# EAGLE design bc-module-epaper (EAGLE 9.6.0)

## Sheet 1 of 2
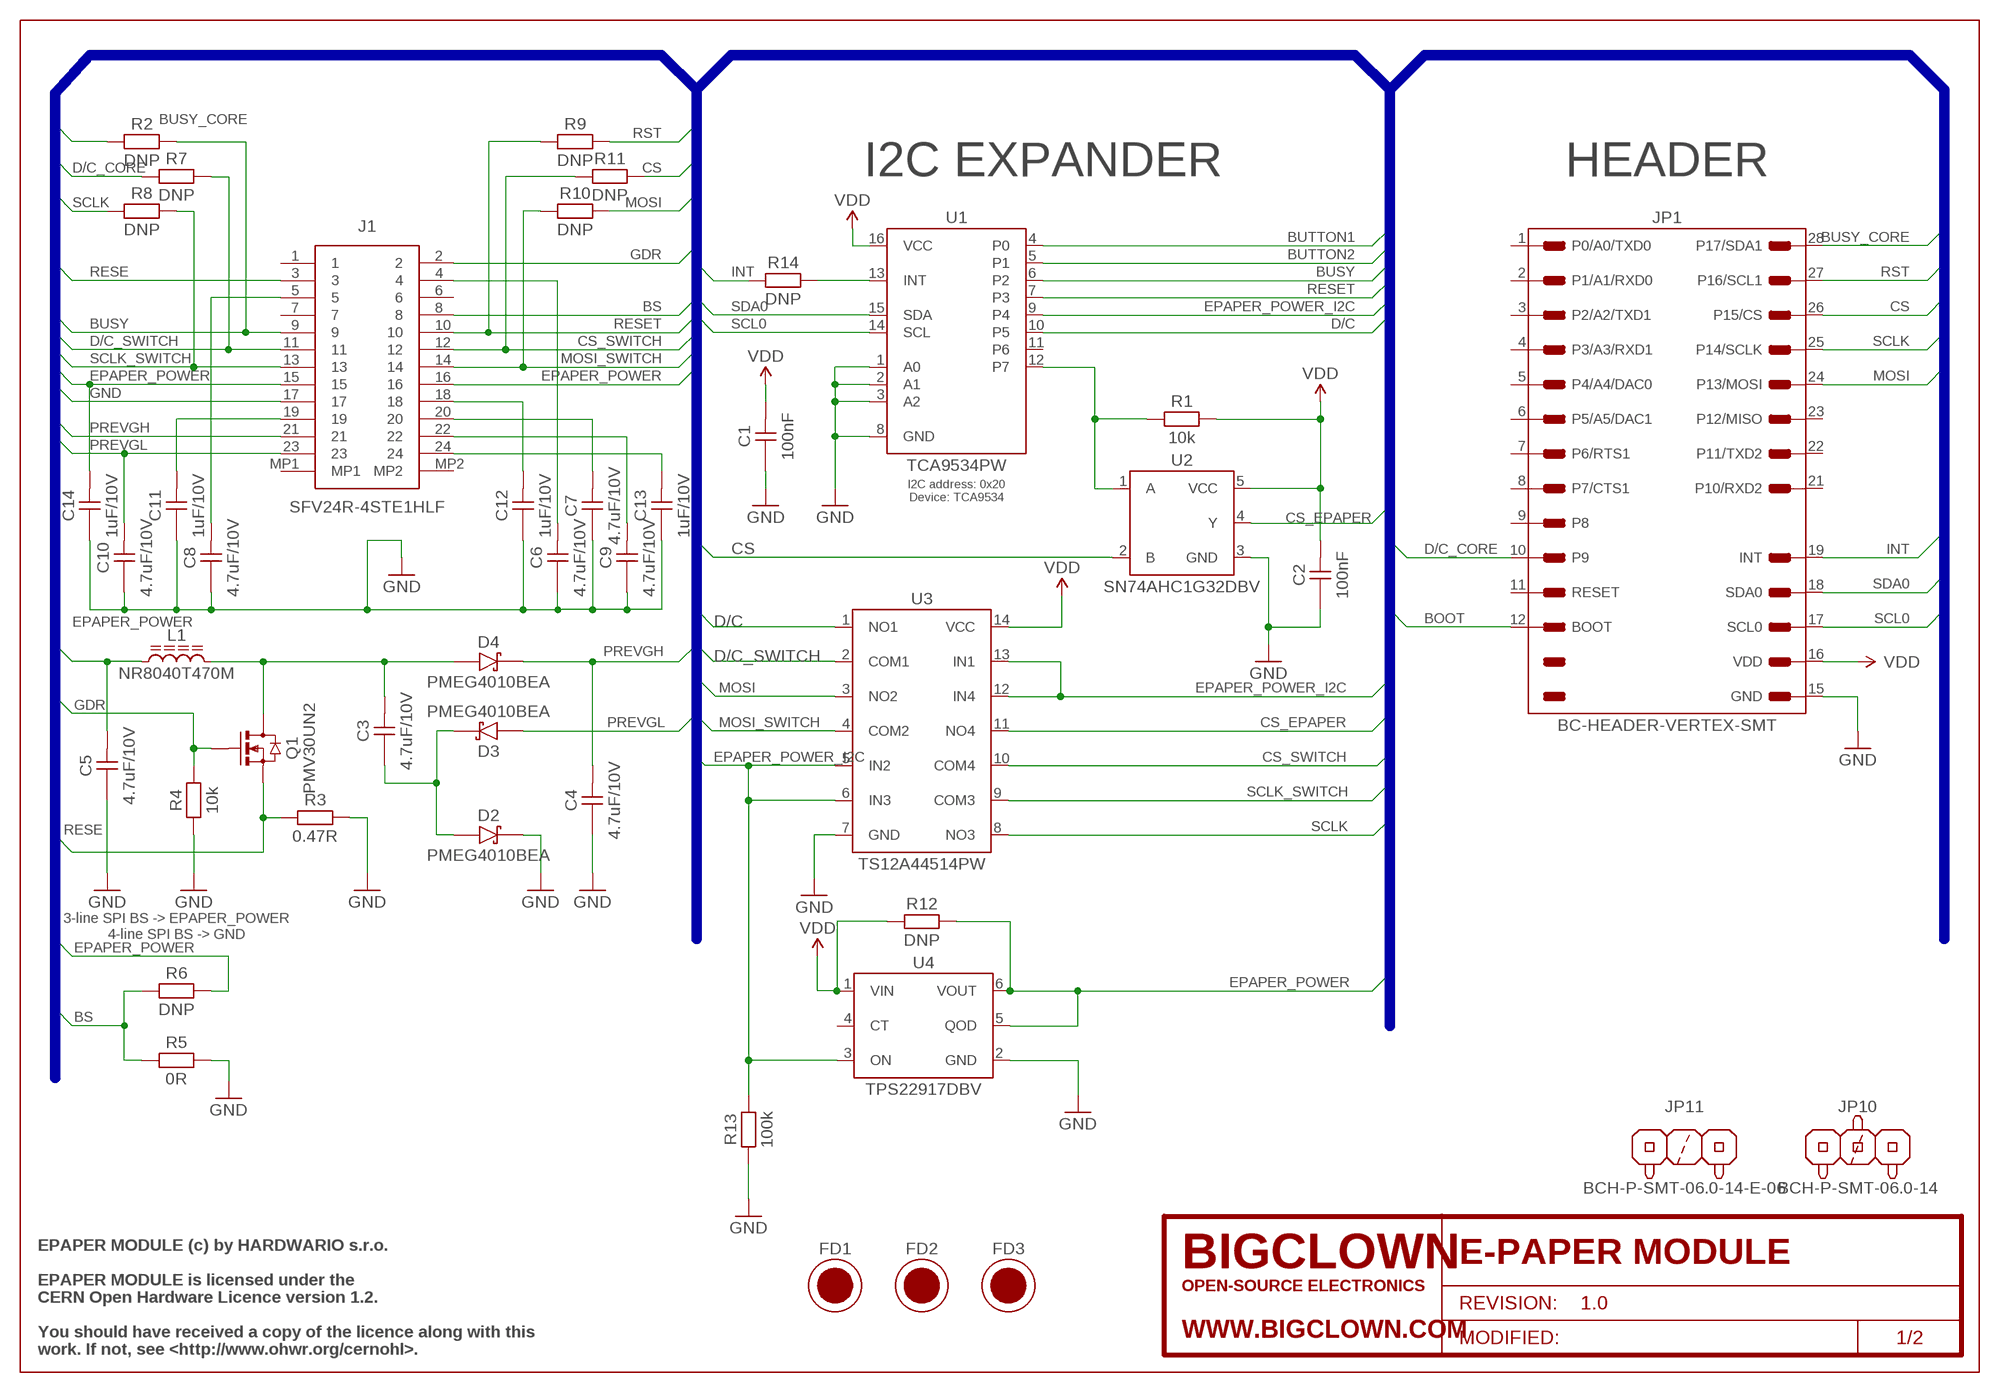
[diagram p0: schematic, sheet 1]

### Parts
C1  100nF  C-0402-100NF  [CAPACITOR-0402_R]
C2  100nF  C-0402-100NF  [CAPACITOR-0402_R]
C3  4.7uF/10V  C-0402-4.7UF-10V  [CAPACITOR-0402_R]
C4  4.7uF/10V  C-0402-4.7UF-10V  [CAPACITOR-0402_R]
C5  4.7uF/10V  C-0402-4.7UF-10V  [CAPACITOR-0402_R]
C6  4.7uF/10V  C-0402-4.7UF-10V  [CAPACITOR-0402_R]
C7  4.7uF/10V  C-0402-4.7UF-10V  [CAPACITOR-0402_R]
C8  4.7uF/10V  C-0402-4.7UF-10V  [CAPACITOR-0402_R]
C9  4.7uF/10V  C-0402-4.7UF-10V  [CAPACITOR-0402_R]
C10  4.7uF/10V  C-0402-4.7UF-10V  [CAPACITOR-0402_R]
C11  1uF/10V  C-0402-1UF-10V  [CAPACITOR-0402_R]
C12  1uF/10V  C-0402-1UF-10V  [CAPACITOR-0402_R]
C13  1uF/10V  C-0402-1UF-10V  [CAPACITOR-0402_R]
C14  1uF/10V  C-0402-1UF-10V  [CAPACITOR-0402_R]
D2  PMEG4010BEA  D-PMEG4010BEA  [SOD-323_R]
D3  PMEG4010BEA  D-PMEG4010BEA  [SOD-323_R]
D4  PMEG4010BEA  D-PMEG4010BEA  [SOD-323_R]
FD1  FIDUCIAL  [FIDUCIAL-1MM]
FD2  FIDUCIAL  [FIDUCIAL-1MM]
FD3  FIDUCIAL  [FIDUCIAL-1MM]
FRAME1  FRAME-SCH/A4L-BRD/A4L  [FRAME-A4L]
J1  SFV24R-4STE1HLF  [SFV24R4STE1HLF]
JP1  BC-HEADER-VERTEX-SMT  BC-HEADER-MODULE-VERTEX-SMT  [BC-HEADER-MODULE-VERTEX-SMT]
JP10  BCH-P-SMT-06.0-14  JP-BCH-P-SMT-06.0-14  [BCH-P-SMT-14]
JP11  BCH-P-SMT-06.0-14-E-06  JP-BCH-P-SMT-06.0-14-E-06  [BCH-P-SMT-14-E-06]
L1  NR8040T470M  L-NR8040T470M  [NR8040T470M_R]
Q1  PMV30UN2  Q-PMV30UN2  [SOT-23_R]
R1  10k  R-0402-10K  [RESISTOR-0402_R]
R2  DNP  R-0402-DNP  [RESISTOR-0402_R]
R3  0.47R  R-0402  [RESISTOR-0402_R]
R4  10k  R-0402-10K  [RESISTOR-0402_R]
R5  0R  R-0402-0R  [RESISTOR-0402_R]
R6  DNP  R-0402-DNP  [RESISTOR-0402_R]
R7  DNP  R-0402-DNP  [RESISTOR-0402_R]
R8  DNP  R-0402-DNP  [RESISTOR-0402_R]
R9  DNP  R-0402-DNP  [RESISTOR-0402_R]
R10  DNP  R-0402-DNP  [RESISTOR-0402_R]
R11  DNP  R-0402-DNP  [RESISTOR-0402_R]
R12  DNP  R-0402-DNP  [RESISTOR-0402_R]
R13  100k  R-0402-100K  [RESISTOR-0402_R]
R14  DNP  R-0402-DNP  [RESISTOR-0402_R]
U1  TCA9534PW  U-TCA9534PW  [TCA9534APW_R]
U2  SN74AHC1G32DBV  U-SN74AHC1G32DBV  [SN74AHC1G32DBV_R]
U3  TS12A44514PW  U-TS12A44514PWR  [TS12A44514PWR_R]
U4  TPS22917DBV  U-TPS22917DBV  [TPS22917DBV_R]

### Nets
BOOT: JP1.12(BOOT)
BS: J1.8 R5.1 R6.1
BUSY: J1.9 R2.2 U1.6(P2)
BUSY_CORE: JP1.28(P17/SDA1) R2.1
BUTTON1: U1.4(P0)
BUTTON2: U1.5(P1)
CS: JP1.26(P15/CS) R11.2 U2.2(B)
CS_EPAPER: U2.4(Y) U3.11(NO4)
CS_SWITCH: J1.12 R11.1 U3.10(COM4)
D/C: U1.10(P5) U3.1(NO1)
D/C_CORE: JP1.10(P9) R7.1
D/C_SWITCH: J1.11 R7.2 U3.2(COM1)
EPAPER_POWER: C5.1 C14.1 J1.15 J1.16 L1.1 R6.2 R12.2 U4.5(QOD) U4.6(VOUT)
EPAPER_POWER_I2C: R13.2 U1.9(P4) U3.5(IN2) U3.6(IN3) U3.12(IN4) U3.13(IN1) U4.3(ON)
GDR: J1.2 Q1.1(G) R4.2
GND: C1.2 C2.2 C4.2 C5.2 C6.2 C7.2 C8.2 C9.2 C10.2 C11.2 C12.2 C13.2 C14.2 D2.1(C) J1.17 JP1.15(GND) R3.2 R4.1 R5.2 R13.1 U1.1(A0) U1.2(A1) U1.3(A2) U1.8(GND) U2.3(GND) U3.7(GND) U4.2(GND)
INT: JP1.19(INT) R14.1
MOSI: JP1.24(P13/MOSI) R10.2 U3.3(NO2)
MOSI_SWITCH: J1.14 R10.1 U3.4(COM2)
N$1: C3.1 D4.2(A) L1.2 Q1.3(D)
N$2: C11.1 J1.19
N$3: C8.1 J1.5
N$4: C3.2 D2.2(A) D3.1(C)
N$5: C6.1 J1.4
N$6: C7.1 J1.20
N$7: C12.1 J1.18
N$8: R14.2 U1.13(INT)
OR_A: R1.2 U1.12(P7) U2.1(A)
PREVGH: C4.1 D4.1(C) J1.21
PREVGL: C10.1 D3.2(A) J1.23
RESE: J1.3 Q1.2(S) R3.1
RESET: J1.10 R9.1 U1.7(P3)
RST: JP1.27(P16/SCL1) R9.2
SCL0: JP1.17(SCL0) U1.14(SCL)
SCLK: JP1.25(P14/SCLK) R8.1 U3.8(NO3)
SCLK_SWITCH: J1.13 R8.2 U3.9(COM3)
SDA0: JP1.18(SDA0) U1.15(SDA)
VCOM: C13.1 J1.24
VDD: C1.1 C2.1 JP1.16(VDD) R1.1 R12.1 U1.16(VCC) U2.5(VCC) U3.14(VCC) U4.1(VIN)
VSL: C9.1 J1.22
Unconnected: J1.1 J1.6 J1.7 J1.MP1 J1.MP2 JP1.1(P0/A0/TXD0) JP1.2(P1/A1/RXD0) JP1.3(P2/A2/TXD1) JP1.4(P3/A3/RXD1) JP1.5(P4/A4/DAC0) JP1.6(P5/A5/DAC1) JP1.7(P6/RTS1) JP1.8(P7/CTS1) JP1.9(P8) JP1.11(RESET) JP1.21(P10/RXD2) JP1.22(P11/TXD2) JP1.23(P12/MISO) U1.11(P6) U4.4(CT)

### Buses
BOOT,BS,BUSY,BUSY_CORE,BUTTON1,BUTTON2,BUTTON3,BUTTON4,CS,CS_EPAPER,CS_SWITCH,D/C,D/C_CORE,D/C_SWITCH,EPAPER_POWER,EPAPER_POWER_I2C,GDR,GND,INT,MOSI,MOSI_SWITCH,OR_A,PREVGH,PREVGL,RESE,RESET,RST,SCL0,SCLK,SCLK_SWITCH,SDA0,VCOM,VDD,VDDD,VGH,VGL,VPP,VSH,VSL

### Notes on the sheet
- I2C EXPANDER | HEADER
- I2C address: 0x20
  Device: TCA9534
- 3-line SPI BS -> EPAPER_POWER
  4-line SPI BS -> GND
- EPAPER MODULE (c) by HARDWARIO s.r.o.
- EPAPER MODULE is licensed under the
- CERN Open Hardware Licence version 1.2.
- You should have received a copy of the licence along with this
- work. If not, see <http://www.ohwr.org/cernohl>.

## Sheet 2 of 2
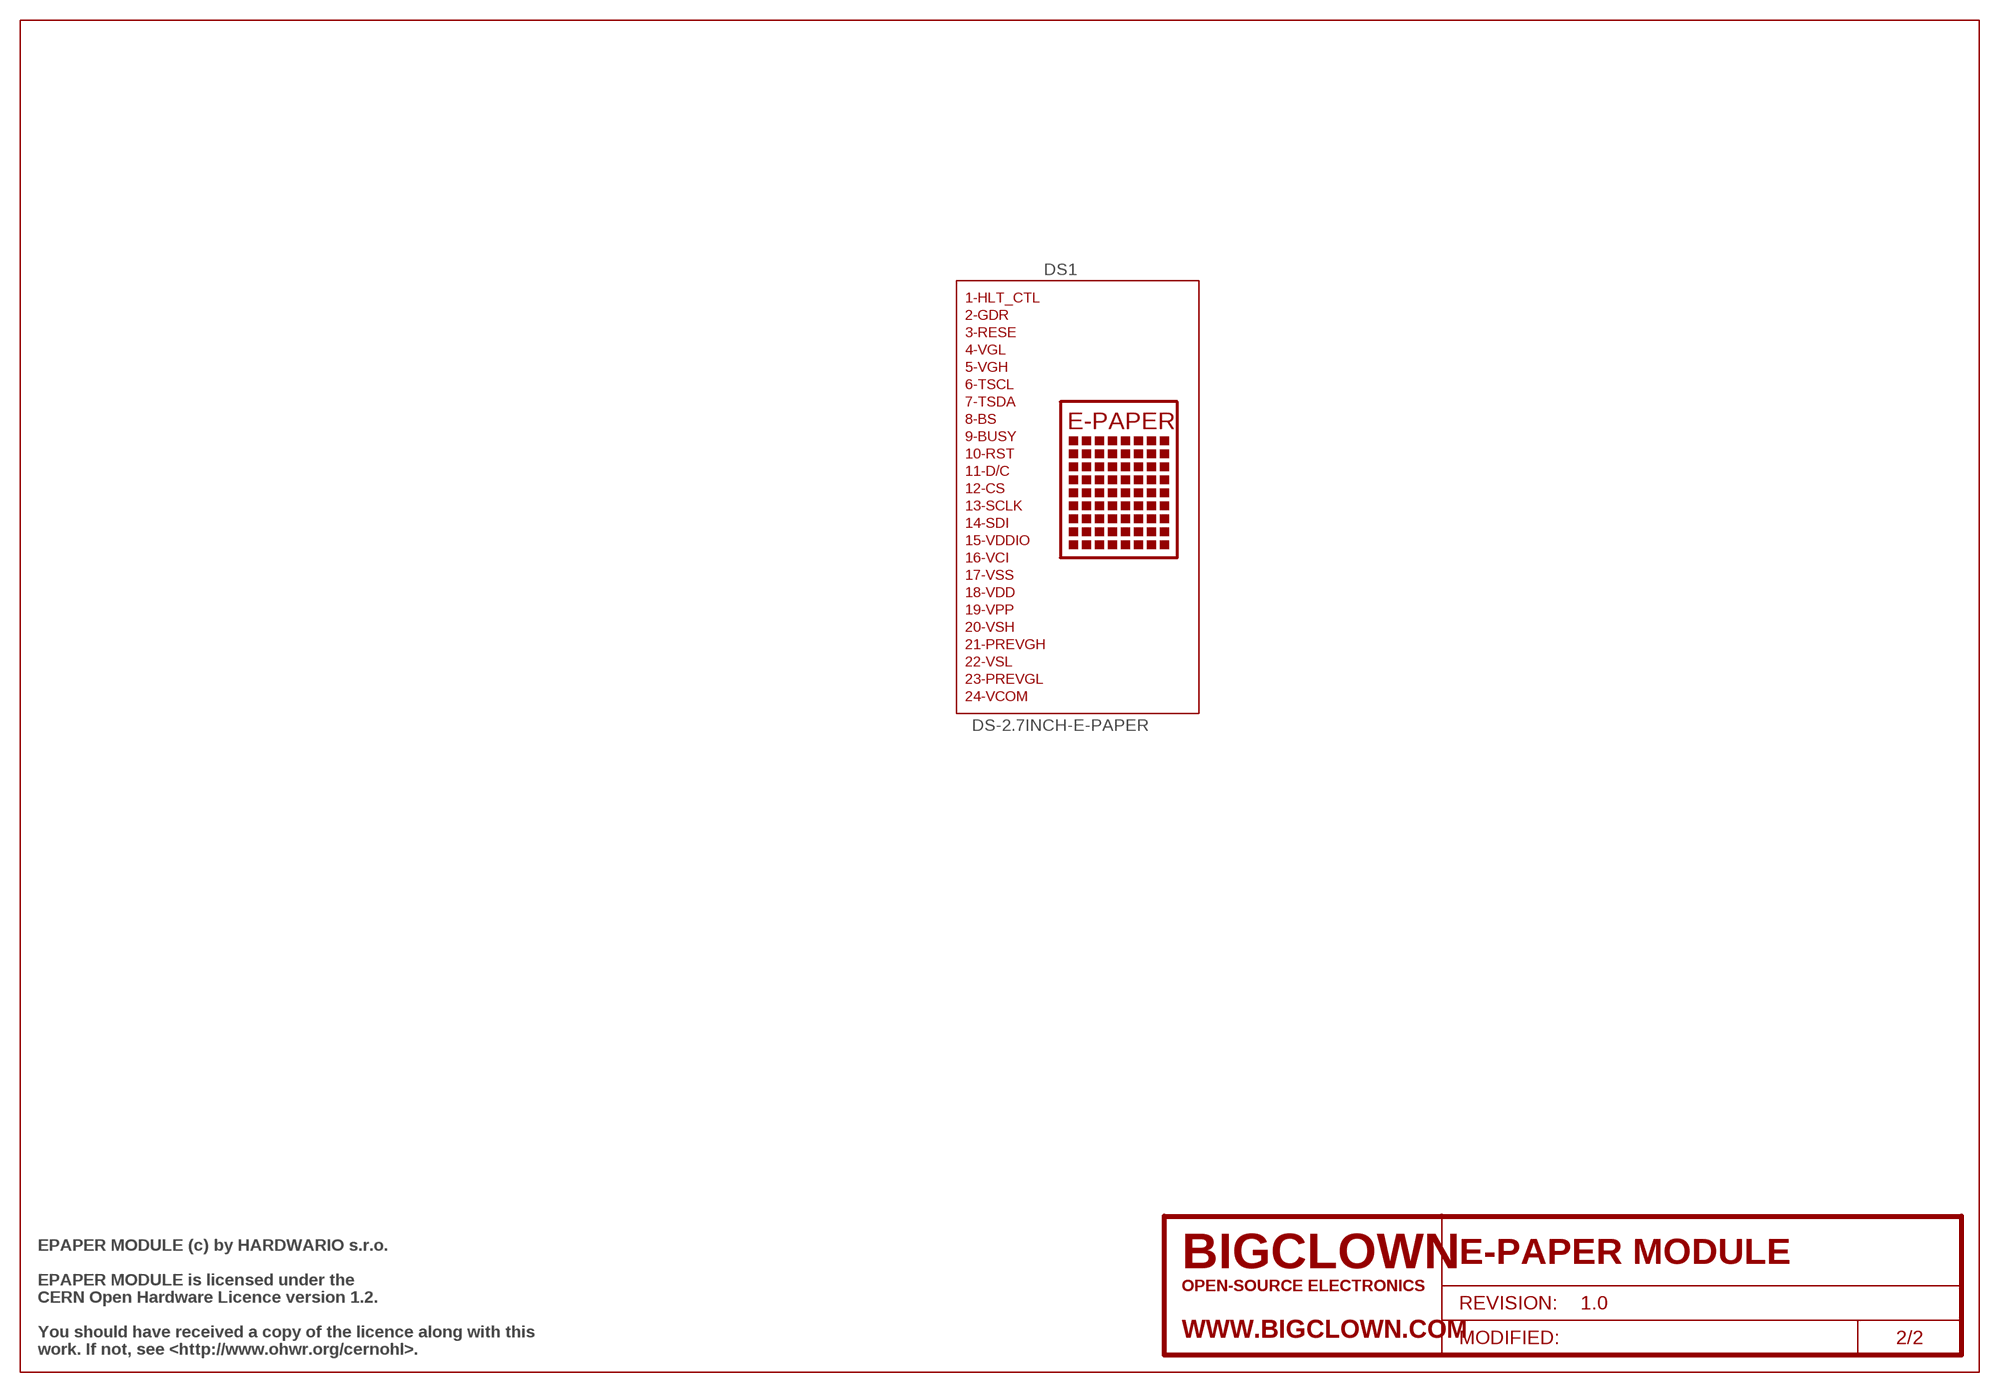
[diagram p1: schematic, sheet 2]

### Parts
DS1  DS-2.7INCH-E-PAPER  [2.7INCH-E-PAPER]
FRAME3  FRAME-SCH/A4L-BRD/A4L  [FRAME-A4L]

### Notes on the sheet
- EPAPER MODULE (c) by HARDWARIO s.r.o.
- EPAPER MODULE is licensed under the
- CERN Open Hardware Licence version 1.2.
- You should have received a copy of the licence along with this
- work. If not, see <http://www.ohwr.org/cernohl>.

## Library data of the parts
C1 C2 = bc-capacitor:C-0402-100NF: Capacitor 100nF 10% ≥10V X7R Package Description: 0402 Mounting Technology: SMT Supplier Name: JabloPCB Supplier Part Number: P+CSM-019.02 Unit Price CZK: 0.2180; BCPN: BC-C-0402-100NF
C3-C10 = bc-capacitor:C-0402-4.7UF-10V: Capacitor 4.7uF 10% 10V X5R Package Description: 0402 Mounting Technology: SMT Supplier Name: JabloPCB Supplier Part Number: P+CSM-035.51 Unit Price CZK: 1.1190; BCPN: BC-C-0402-4.7UF-10V
C11-C14 = bc-capacitor:C-0402-1UF-10V: Capacitor 1uF 10% 10V X5R Part Status: Core Package Description: 0402 Mounting Technology: SMT Supplier Name: JabloPCB Supplier Part Number: P+CSM-034.00 Unit Price CZK: 0.1480; BCPN: BC-C-0402-1UF-10V
D2-D4 = bc-discrete:D-PMEG4010BEA: Shottky Diode 1A 40V 0,64V Ir 20 uA Part Status: Power Package Description: SOD-323 Mounting Technology: SMT; BCPN: BC-D-PMEG4010BEA
DS1 = bc-display:DS-2.7INCH-E-PAPER: E-PAPER 2.7" 264x176 Package Description: 70.42x45.8mm Manufacturer Name: WAVESHARE Manufacturer Part Number: 2.7inch e-Paper Supplier Name: WAVESHARE Unit Price USD: 9.99; BCPN: BC-DS-2.7INCH-E-PAPER
FD1-FD3 = bc-fiducial:FIDUCIAL; BCPN: -
FRAME1 FRAME3 = bc-frame:FRAME-SCH/A4L-BRD/A4L; BCPN: -; PROJECT_NAME: E-PAPER MODULE; PROJECT_REVISION: 1.0
J1 = SFV24R-4STE1HLF:SFV24R-4STE1HLF: FFC & FPC Connectors 24P R/A SMT FFC/FPC 0.5mm CONT SPACING Source: Datasheet <https://componentsearchengine.com/Datasheets/1/SFV24R-4STE1HLF.pdf>; DESCRIPTION: FFC & FPC Connectors 24P R/A SMT FFC/FPC 0.5mm CONT SPACING; HEIGHT: 2mm; MANUFACTURER_NAME: FCI; MANUFACTURER_PART_NUMBER: SFV24R-4STE1HLF; MOUSER_PART_NUMBER: 649-SFV24R-4STE1HLF; MOUSER_PRICE-STOCK: https://www.mouser.com/Search/Refine.aspx?Keyword=649-SFV24R-4STE1HLF
JP1 = bc-header:BC-HEADER-MODULE-VERTEX-SMT: 14pin SMT pin header +14pin SMT pin header empty pin 6 with no socket position from top side of PCB Use this pattern for a top floor Module of BigClown stackup without top connector for next module and without additional power supply (e. g. LCD Module, Climate Module, PIR Module). Mounting Technology: SMT; BCPN: -
JP10 = bc-header:JP-BCH-P-SMT-06.0-14: SMT Pin 6.0mm 14-pin type 1 Part Status: A Package Description: pitch 2.54mm Mounting Technology: SMT Manufacturer Name: Amtek Manufacturer Part Number: 5PH1MSB25-114S0NBCU-060050033-0 Supplier Name: Amtek Unit Price CZK: 2.5520 Unit Price USD: 0.1160 MPU (pcs): 15; BCPN: BC-JP-BCH-P-SMT-06.0-14
JP11 = bc-header:JP-BCH-P-SMT-06.0-14-E-06: SMT Pin 6.0mm 14-pin type 1 empty pin 6 Part Status: A Package Description: pitch 2.54mm Mounting Technology: SMT Manufacturer Name: Amtek Manufacturer Part Number: 5PH1MSB25-114S0NBCU-060050M01-01 Supplier Name: Amtek Unit Price CZK: 2.7214 Unit Price USD: 0.1237 MPU (pcs): 15; BCPN: BC-JP-BCH-P-SMT-06.0-14-E-06
L1 = bc-inductor:L-NR8040T470M: Inductor 47uH 20% 1.4A 0.15Ohm Part Status: Power Package Description: 8.0x8.0mm Mounting Technology: SMT Manufacturer Name: Taiyo Yuden Manufacturer Part Number: NR8040T470M Supplier Name: Mouser, Avnet, DK Unit Price CZK: 0.0000; BCPN: BC-L-NR8040T470M
Q1 = bc-discrete:Q-PMV30UN2: N-MOS 20V 5.4A 24mOhm Package Description: SOT-23 Mounting Technology: SMT Manufacturer Name: Nexperia Manufacturer Part Number: PMV30UN2 Supplier Name: Avnet Silica Unit Price CZK: 0.9620 Unit Price EUR: 0.037 MOQ (pcs): 12000 MPU (pcs): 3000 L/T (weeks): 2; BCPN: BC-Q-PMV30UN2
R1 R4 = bc-resistor:R-0402-10K: Resistor 10k 1% 100ppm 63mW Package Description: 0402 Mounting Technology: SMT Supplier Name: JabloPCB Supplier Part Number: RSM-248.00 Unit Price CZK: 0.0180; BCPN: BC-R-0402-10K
R2 R6-R12 R14 = bc-resistor:R-0402-DNP; BCPN: -
R3 = bc-resistor:R-0402
R5 = bc-resistor:R-0402-0R: Resistor 0R 63mW Package Description: 0402 Mounting Technology: SMT Supplier Name: JabloPCB Unit Price CZK: 0.0500; BCPN: BC-R-0402-0R
R13 = bc-resistor:R-0402-100K: Resistor 100k 1% 100ppm 63mW Part Status: Core Package Description: 0402 Mounting Technology: SMT Supplier Name: JabloPCB Supplier Part Number: RSM-260.00 Unit Price CZK: 0.0180; BCPN: BC-R-0402-100K
U1 = bc-interface:U-TCA9534PW: I2C Expander 1.65-5.5V, alternate address to TCA9534A Package Description: TSSOP-16 Mounting Technology: SMT Manufacturer Name: Texas Instruments Manufacturer Part Number: TCA9534APWR Supplier Name: EBV Unit Price CZK: 6.6000 Unit Price USD: 0.3000 MOQ (pcs): 2000; BCPN: BC-U-TCA9534PW
U2 = bc-logic:U-SN74AHC1G32DBV: OR Gate 2.0-5.5V 10µA Package Description: SOT-23 Mounting Technology: SMT Manufacturer Name: Texas Instruments Manufacturer Part Number: SN74AHC1G32DBV Supplier Name: EBV Unit Price CZK: 0.6600 Unit Price USD: 0.0300 MOQ (pcs): 3000 L/T (weeks): 6; BCPN: BC-U-SN74AHC1G32DBV
U3 = bc-switch:U-TS12A44514PWR: Analog switch 4-Channel SPST 3.5 Ohm 2-12 V Package Description: TSSOP-14 Mounting Technology: SMT Manufacturer Name: Texas Instruments Manufacturer Part Number: TS12A44514PWR Supplier Name: Mouser; BCPN: BC-U-TS12A44514PW
U4 = bc-switch:U-TPS22917DBV: Load switch P-MOS 1-1.55V 2A 90mOhm @-3.6V Package Description: SOT-23-6 Mounting Technology: SMT Manufacturer Name: Texas Instruments Manufacturer Part Number: TPS22917DBV Supplier Name: EBV Unit Price CZK: 3.5200 Unit Price USD: 0.1600; BCPN: BC-U-TPS22917DBV

## Board
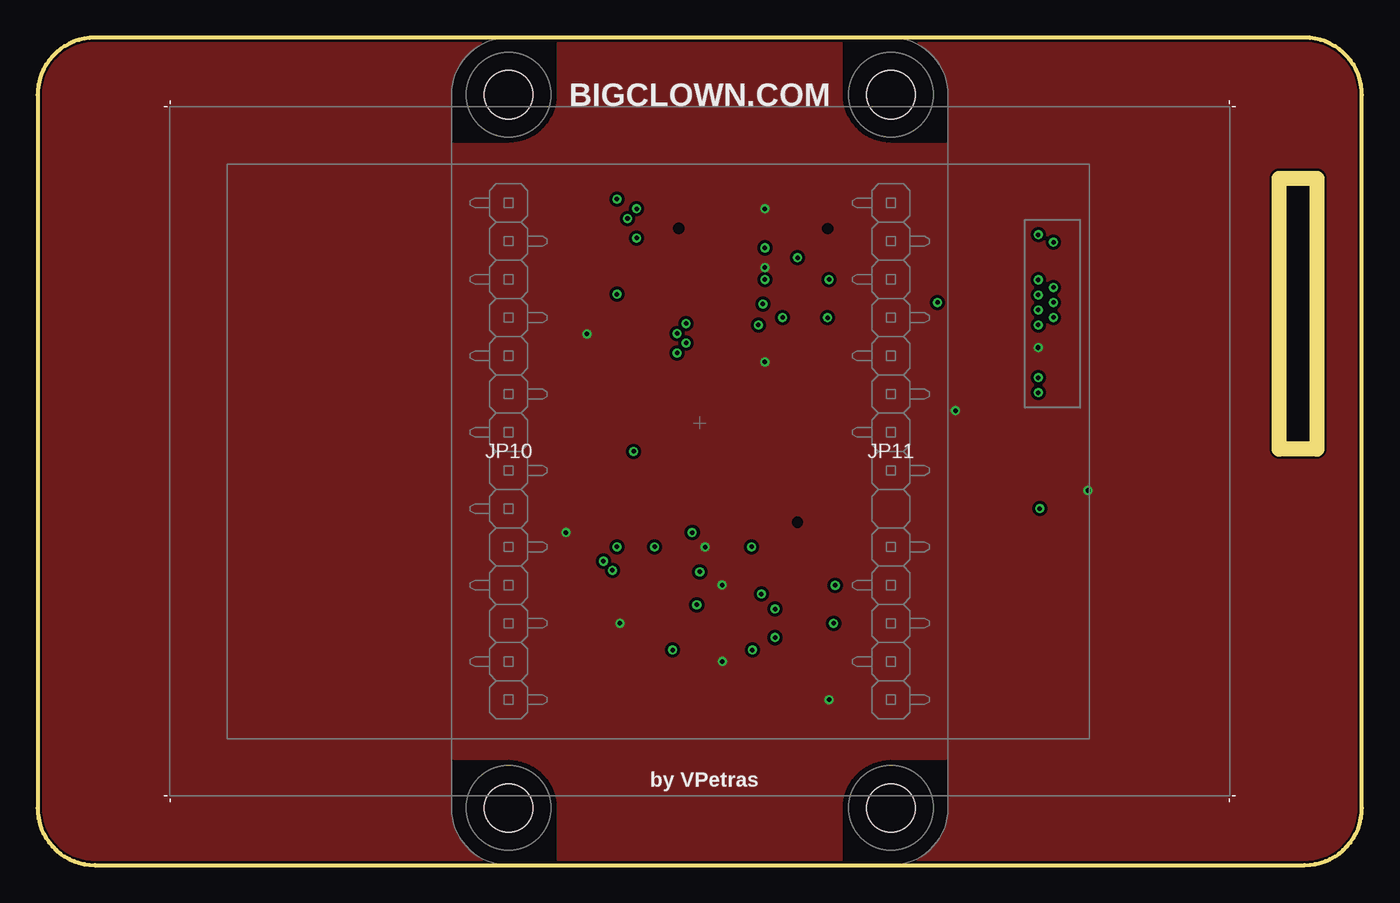
[diagram p2: board, top side]
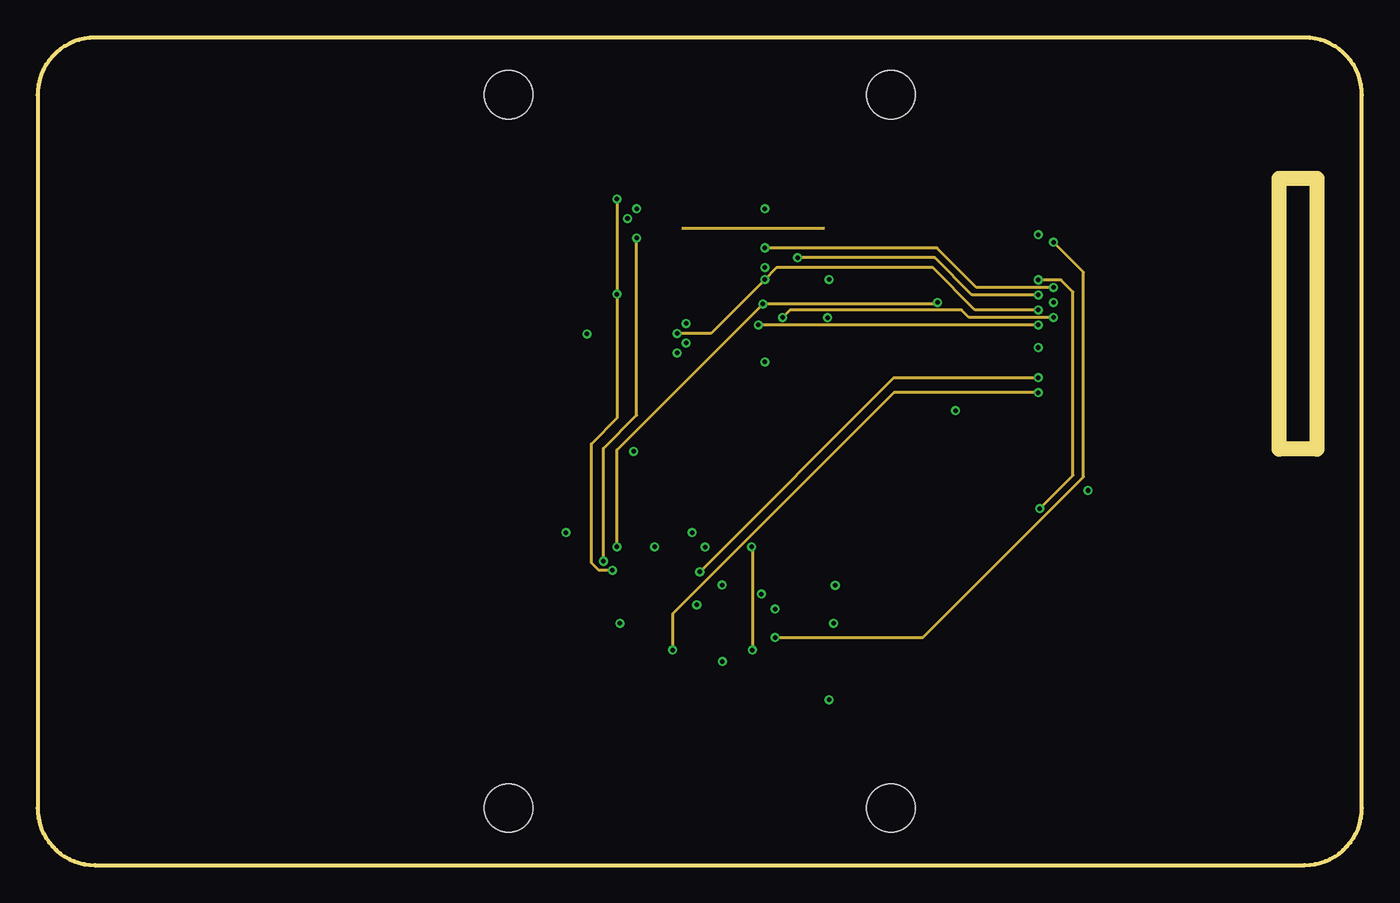
[diagram p3: board, inner layer Route2]
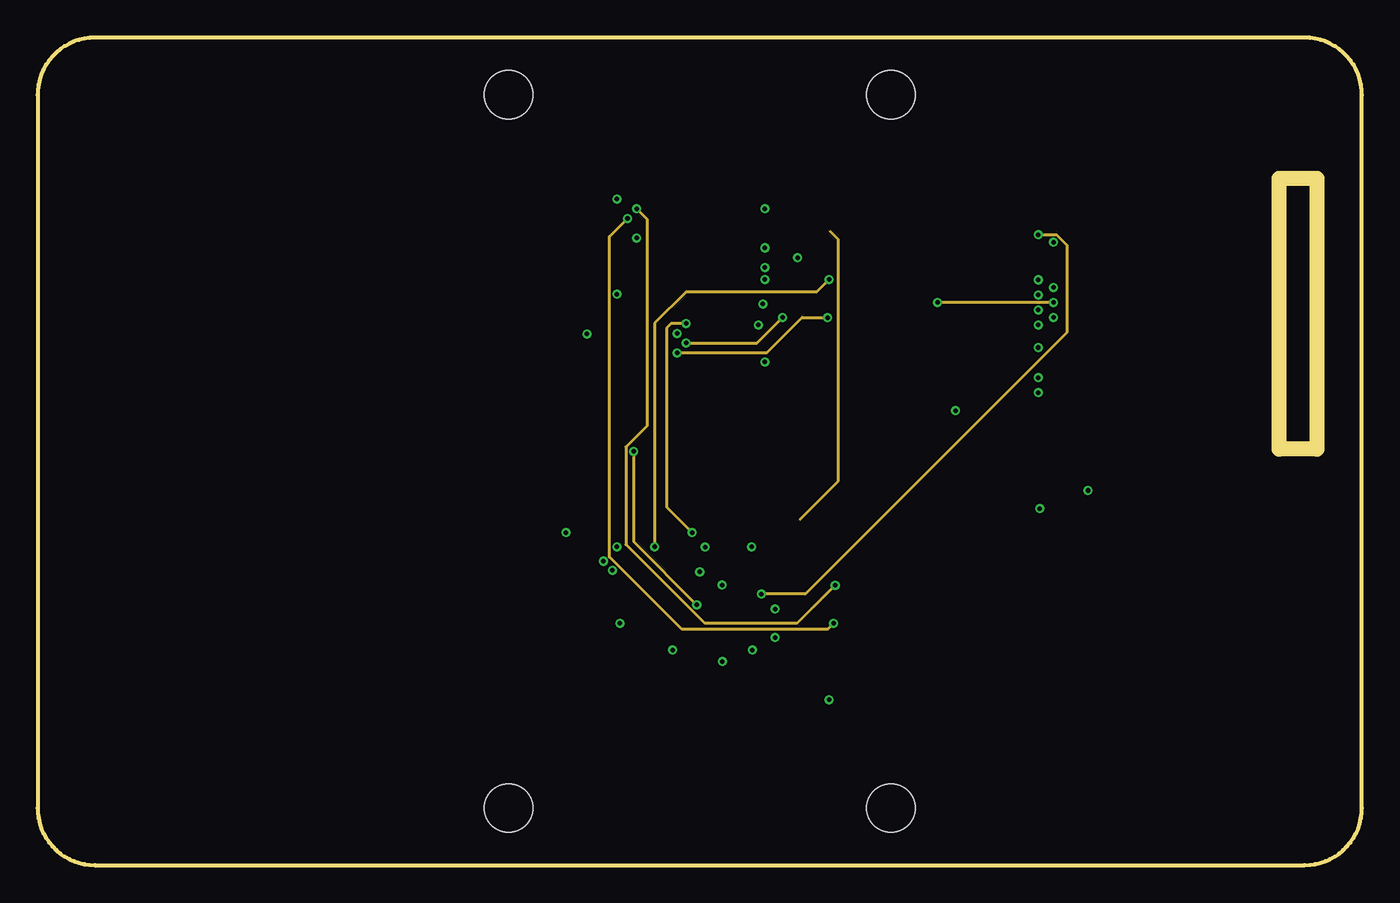
[diagram p4: board, inner layer Route15]
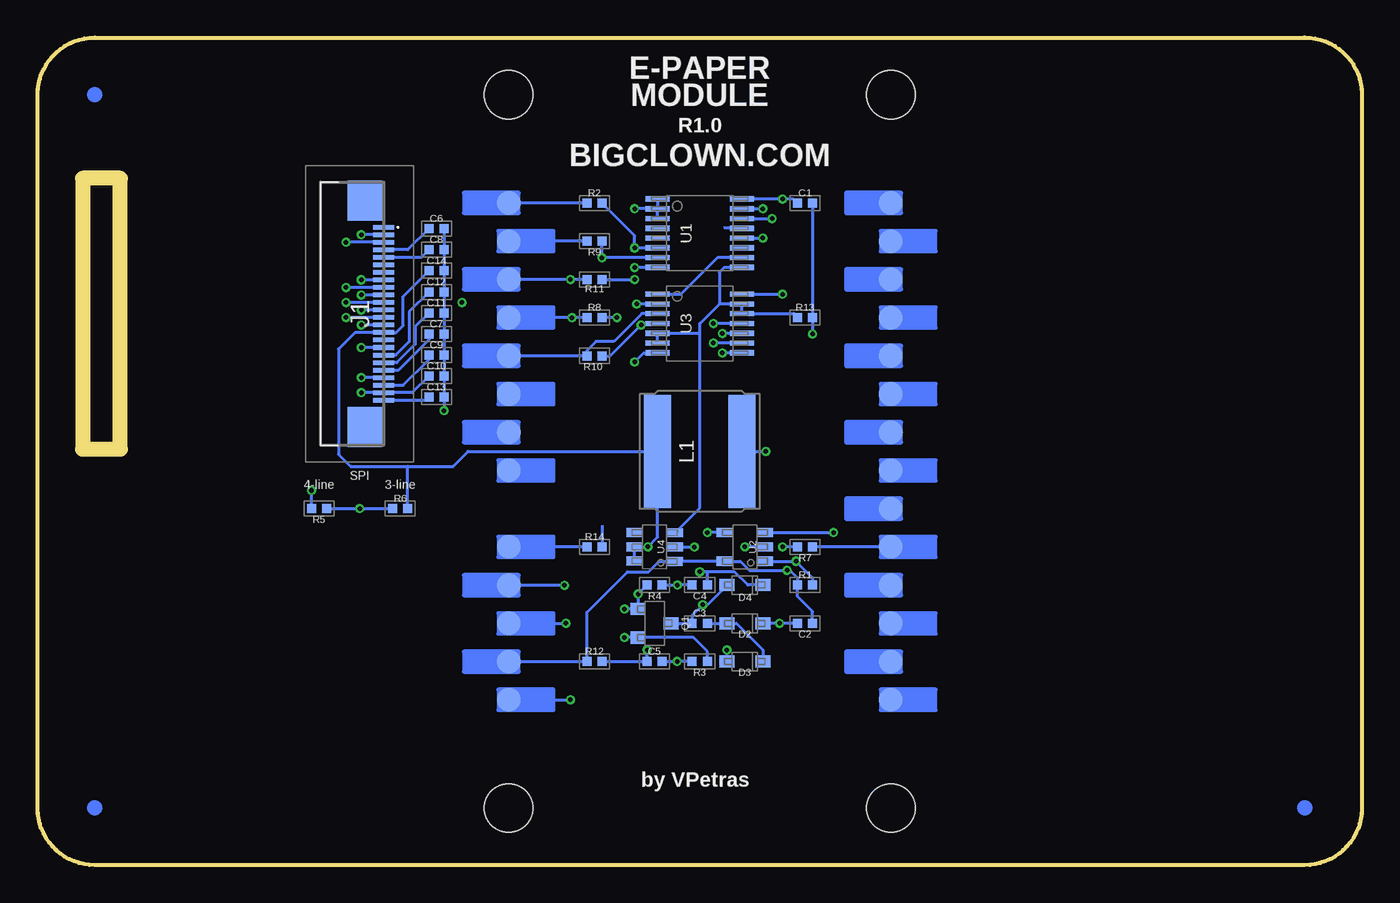
[diagram p5: board, bottom side, seen from below]

Size 88 x 55 mm. Coordinates in mm from the lower left corner, seen from the top.
Outline: 3.8,0 84.2,0 arc90 88,3.8 88,51.2 arc90 84.2,55 3.8,55 arc90 0,51.2 0,3.8 arc90 3.8,0
Outline: 82.51,45.65 85.01,45.65 85.01,27.65 82.51,27.65 82.51,45.65
Copper layers (1+2*15+16): Top 0.035mm / dielectric 1mm / Route2 0.016mm / dielectric 0.2mm / Route15 0.016mm / dielectric 0.35mm / Bottom 0.035mm
Design rules "bc-2-layer-hd *": minimum track width 0.2mm, minimum drill 0.3mm, track to track 0.2mm, track to pad 0.2mm, pad to pad 0.2mm, via to via 0.2mm, smd to smd 0mil, copper to edge 0.15mm, drill to drill 0.5mm, minimum pad ring 0mil, minimum via ring 0mil, stop-mask expansion 0.05mm, vias tented up to drill 0.5mm, thermal gap 0.3mm

### Footprints (pad centres in the part's own frame; a part is rotated, then mirrored left to right if it is on the bottom)
CAPACITOR-0402_R = smd 0.6 x 0.6: 1 -0.5,0; 2 0.5,0
SOD-323_R = smd 1 x 0.8: 1 -1.2,0; 2 1.2,0
SFV24R4STE1HLF = smd 0.3 x 1.4: 1 -5.75,2.1; 2 -5.25,2.1; 3 -4.75,2.1; 4 -4.25,2.1; 5 -3.75,2.1; 6 -3.25,2.1; 7 -2.75,2.1; 8 -2.25,2.1; 9 -1.75,2.1; 10 -1.25,2.1; 11 -0.75,2.1; 12 -0.25,2.1; 13 0.25,2.1; 14 0.75,2.1; 15 1.25,2.1; 16 1.75,2.1; 17 2.25,2.1; 18 2.75,2.1; 19 3.25,2.1; 20 3.75,2.1; 21 4.25,2.1; 22 4.75,2.1; 23 5.25,2.1; 24 5.75,2.1 | smd 2.65 x 2.3: MP1 -7.525,0.85; MP2 7.525,0.85
BC-HEADER-MODULE-VERTEX-SMT = smd 1.6 x 1.6 bottom: 1 -12.7,16.51; 2 -12.7,13.97; 3 -12.7,11.43; 4 -12.7,8.89; 5 -12.7,6.35; 6 -12.7,3.81; 7 -12.7,1.27; 8 -12.7,-1.27; 9 -12.7,-3.81; 10 -12.7,-6.35; 11 -12.7,-8.89; 12 -12.7,-11.43; 13 -12.7,-13.97; 14 -12.7,-16.51; 15 12.7,-16.51; 16 12.7,-13.97; 17 12.7,-11.43; 18 12.7,-8.89; 19 12.7,-6.35; 21 12.7,-1.27; 22 12.7,1.27; 23 12.7,3.81; 24 12.7,6.35; 25 12.7,8.89; 26 12.7,11.43; 27 12.7,13.97; 28 12.7,16.51 | hole 3.2: -12.7,23.7; 12.7,23.7; -12.7,-23.7; 12.7,-23.7
NR8040T470M_R = smd 1.8 x 7.5: 1 -2.8,0; 2 2.8,0
SOT-23_R = smd 1 x 0.8: 1 -1.1,0.95; 2 -1.1,-0.95; 3 1.1,0
RESISTOR-0402_R = smd 0.6 x 0.6: 1 -0.5,0; 2 0.5,0
TCA9534APW_R = smd 1.6 x 0.35: 1 -2.8,2.275; 2 -2.8,1.625; 3 -2.8,0.975; 4 -2.8,0.325; 5 -2.8,-0.325; 6 -2.8,-0.975; 7 -2.8,-1.625; 8 -2.8,-2.275; 9 2.8,-2.275; 10 2.8,-1.625; 11 2.8,-0.975; 12 2.8,-0.325; 13 2.8,0.325; 14 2.8,0.975; 15 2.8,1.625; 16 2.8,2.275
SN74AHC1G32DBV_R = smd 1.05 x 0.6: 1 -1.35,0.95; 2 -1.35,0; 3 -1.35,-0.95; 4 1.35,-0.95; 5 1.35,0.95
TS12A44514PWR_R = smd 1.6 x 0.35: 1 -2.8,1.956; 2 -2.8,1.295; 3 -2.8,0.66; 4 -2.8,0; 5 -2.8,-0.66; 6 -2.8,-1.295; 7 -2.8,-1.956; 8 2.8,-1.956; 9 2.8,-1.295; 10 2.8,-0.66; 11 2.8,0; 12 2.8,0.66; 13 2.8,1.295; 14 2.8,1.956
TPS22917DBV_R = smd 1.05 x 0.6: 1 -1.35,0.95; 2 -1.35,0; 3 -1.35,-0.95; 4 1.35,-0.95; 5 1.35,0; 6 1.35,0.95

### Placement (x,y rotation side)
C1  37,44 0 bottom
C2  37,16.07 180 bottom
C3  44,16.07 0 bottom
C4  44,18.61 180 bottom
C5  47,13.53 0 bottom
C6  61.5,42.3 0 bottom
C7  61.5,35.3 0 bottom
C8  61.5,40.9 0 bottom
C9  61.5,33.9 0 bottom
C10  61.5,32.5 0 bottom
C11  61.5,36.7 0 bottom
C12  61.5,38.1 0 bottom
C13  61.5,31.1 0 bottom
C14  61.5,39.5 0 bottom
D2  41,16.07 180 bottom
D3  41,13.53 180 bottom
D4  41,18.61 180 bottom
DS1  44,27.5 0 top
FD1  3.8,3.8 0 bottom
FD2  84.2,3.8 0 bottom
FD3  84.2,51.2 0 bottom
FRAME1  44,27.5 0 top
FRAME3  44,27.5 0 top
J1  67.1,36.65 270 bottom
JP1  44,27.5 0 top
JP10  31.3,27.5 0 top
JP11  56.7,27.5 0 top
L1  44,27.5 0 bottom
Q1  47,16.07 0 bottom
R1  37,18.61 0 bottom
R2  51,44 0 bottom
R3  44,13.53 180 bottom
R4  47,18.61 180 bottom
R5  69.3,23.69 180 bottom
R6  63.9,23.69 0 bottom
R7  37,21.15 180 bottom
R8  51,36.39 0 bottom
R9  51,41.47 180 bottom
R10  51,33.85 180 bottom
R11  51,38.93 180 bottom
R12  51,13.53 0 bottom
R13  37,36.39 180 bottom
R14  51,21.15 0 bottom
U1  44,42 0 bottom
U2  41,21.15 180 bottom
U3  44,36 0 bottom
U4  47,21.15 179.7 bottom

### Tracks (layer width: path | path; a pad name or v marks a point on that pad's centre or on a via)
BS  (via drill 0.3 pad 0.6)
  Route2 0.2: v66.6,23.69 v66.6,23.7 68.8,25.9 68.8,38.1 68,38.9 v66.5,38.9
  Bottom 0.2: R5.1 v66.6,23.69 R6.1 | J1.8 v66.5,38.9
BUSY  (via drill 0.3 pad 0.6)
  Route2 0.2: v67.5,38.4 62.4,38.4 59.77,41.02 v48.33,41.02
  Bottom 0.2: U1.6 v48.33,41.02 48.33,41.83 R2.2 | J1.9 v67.5,38.4
BUSY_CORE
  Bottom 0.2: R2.1 JP1.28
CS  (via drill 0.3 pad 0.6)
  Route15 0.2: v41,21.15 41,36.01 43.09,38.1 51.77,38.1 v52.6,38.93
  Bottom 0.2: R11.2 v52.6,38.93 JP1.26 | U2.2 v41,21.15
CS_EPAPER  (via drill 0.3 pad 0.6)
  Route15 0.2: v43.1,36 42.1,36 41.8,35.7 41.8,23.8 v43.5,22.1
  Bottom 0.2: U2.4 v43.5,22.1 | U3.11 v43.1,36
CS_SWITCH  (via drill 0.3 pad 0.6)
  Route2 0.2: v66.5,36.9 62.3,36.9 59.5,39.7 49.09,39.7 | 49.09,39.7 | v42.5,35.34 44.73,35.34 v48.33,38.93 49.09,39.7
  Bottom 0.2: J1.12 v66.5,36.9 | R11.1 v48.33,38.93 | U3.10 v42.5,35.34
D/C
  Bottom 0.2: U1.10 42.83,40.38 45.24,37.96 U3.1
D/C_CORE
  Bottom 0.2: JP1.10 R7.1
D/C_SWITCH  (via drill 0.3 pad 0.6)
  Route2 0.2: v38.5,21.15 38.5,27.6 v48.2,37.3 59.7,37.3 v59.8,37.4
  Route15 0.2: v67.5,37.4 v59.8,37.4
  Bottom 0.2: J1.11 v67.5,37.4 | U3.2 v48.2,37.3 | R7.2 v38.5,21.15
EPAPER_POWER  (via drill 0.3 pad 0.6)
  Route2 0.2: v47.44,21.16 47.5,21.1 v47.5,14.3
  Bottom 0.2: J1.15 64.17,35.4 63.7,35.87 63.7,37.8 C14.1 | J1.16 J1.15 | R12.2 C5.1 v47.5,14.3 | U4.6 U4.5 v47.44,21.16 46.8,21.8 L1.1 59.4,27.5 60.4,26.5 63.4,26.5 | J1.15 66.9,35.4 68,34.3 68,27.3 67.2,26.5 63.4,26.5 | R6.2 63.4,26.5
EPAPER_POWER_I2C
  Bottom 0.2: R13.2 37.77,36.66 U3.12 U3.13 42.7,37.3 | 44,35.34 U3.5 U3.6 | U4.3 44,23.74 44,35.34 | 44,35.34 44,36 42.7,37.3 | U1.9 42.38,39.73 42.7,39.4 42.7,37.3
GDR  (via drill 0.3 pad 0.6)
  Route15 0.2: v66.5,41.9 67.7,41.9 68.4,41.2 68.4,35.4 51.01,18.01 v48.1,18.01
  Bottom 0.2: R4.2 v48.1,18.01 Q1.1 v49,17.02 | J1.2 v66.5,41.9
GND  (via drill 0.3 pad 0.6)
  Bottom 0.2: C6.2 C8.2 C14.2 C12.2 C11.2 C7.2 C9.2 C10.2 C13.2 v61,30.2 | J1.17 v66.5,34.4 | R5.2 v69.8,24.9 | JP1.15 v52.6,10.99 | R3.2 v45.5,13.53 C5.2 | C4.2 v45.49,18.61 R4.1 | C2.2 v38.7,16.07 D2.1 | U2.3 v35.1,22.1 | C1.2 R13.1 v36.5,35.3 | U1.2 v48.33,43.62 | U1.3 U1.2 | U1.1 U1.2 | U1.8 v48.33,39.73 | v48.33,33.44 47.73,34.04 U3.7 | U4.2 v44.35,21.14
  pour Top: 3.8,0 84.2,0 arc90 88,3.8 88,51.2 arc90 84.2,55 3.8,55 arc90 0,51.2 0,3.8 arc90
INT
  Bottom 0.2: R14.1 JP1.19
MOSI
  Bottom 0.2: JP1.24 R10.2 51.5,34.2 50.9,34.8 49.7,34.8 47.84,36.66 U3.3
MOSI_SWITCH  (via drill 0.3 pad 0.6)
  Route2 0.2: v66.5,35.9 v47.9,35.9
  Bottom 0.2: U3.4 47.8,36 v47.9,35.9 49.95,33.85 R10.1 | J1.14 v66.5,35.9
N$1  (via drill 0.3 pad 0.6)
  Route15 0.2: v39.6,27.5 39.6,21.5 v43.8,17.3
  Bottom 0.2: Q1.3 C3.1 44.5,16.6 v43.8,17.3 43.5,17.3 D4.2 | L1.2 v39.6,27.5
N$2
  Bottom 0.2: J1.19 64.13,33.4 62.9,34.63 62.9,35.8 C11.1
N$3
  Bottom 0.2: C8.1 62.5,40.4 J1.5
N$4
  Bottom 0.2: C3.2 D2.2 41.57,16.07 39.8,14.3 D3.1
N$5
  Bottom 0.2: C6.1 63.4,40.9 J1.4
N$6
  Bottom 0.2: J1.20 64.02,32.9 62,34.92 C7.1
N$7
  Bottom 0.2: J1.18 64.2,33.9 63.3,34.8 63.3,36.8 C12.1
N$8  (via drill 0.35)
  Route2 0.2: v42.6,42.33 52.5,42.33 v52.5,42.3
  Route15 0.2: v52.5,42.3 53.2,41.6 53.2,25.5 v50.5,22.8
  Bottom 0.2: U1.13 v42.6,42.33 | v50.5,22.8 R14.2
OR_A  (via drill 0.3 pad 0.6)
  Route2 0.2: v37.6,20.2 37.6,27.7 39.8,29.9 v39.8,41.67
  Bottom 0.2: U2.1 v37.6,20.2 36.5,19.1 R1.2 | U1.12 v39.8,41.67
PREVGH  (via drill 0.3 pad 0.6)
  Route2 0.2: v44,19.5 56.9,32.4 v66.5,32.4
  Bottom 0.2: D4.1 40.81,18.61 41.7,19.5 43.5,19.5 | 43.5,19.5 v44,19.5 | J1.21 v66.5,32.4 | C4.1 43.5,19.5
PREVGL  (via drill 0.3 pad 0.6)
  Route2 0.2: v66.5,31.4 56.9,31.4 42.2,16.7 v42.2,14.3
  Bottom 0.2: C10.1 63.1,31.4 J1.23 v66.5,31.4 | D3.2 v42.2,14.3
RESE  (via drill 0.3 pad 0.6)
  Route2 0.2: v49,15.12 58.82,15.12 69.5,25.8 69.5,39.4 v67.5,41.4
  Bottom 0.2: J1.3 v67.5,41.4 | v49,15.12 Q1.2 44.42,15.12 43.5,14.2 R3.1
RESET  (via drill 0.3 pad 0.6)
  Route2 0.2: v66.5,37.9 62.1,37.9 59.62,40.38 v50.51,40.38
  Bottom 0.2: R9.1 v50.5,40.38 v50.51,40.38 U1.7 | J1.10 v66.5,37.9
RST
  Bottom 0.2: R9.2 JP1.27
SCL0  (via drill 0.3 pad 0.6)
  Route15 0.2: v39.2,42.98 38,41.77 38,20.48 42.81,15.67 52.5,15.67 v52.9,16.07
  Bottom 0.2: JP1.17 v52.9,16.07 | U1.14 v39.2,42.98
SCLK  (via drill 0.3 pad 0.6)
  Route15 0.2: v42.5,34.04 48.44,34.04 50.8,36.4 v52.49,36.4 v52.5,36.39
  Bottom 0.2: R8.1 v52.5,36.39 JP1.25 | U3.8 v42.5,34.04
SCLK_SWITCH  (via drill 0.3 pad 0.6)
  Route2 0.2: v67.5,36.4 61.9,36.4 61.4,36.9 50,36.9 v49.5,36.4
  Route15 0.2: v43.1,34.7 47.8,34.7 v49.5,36.4
  Bottom 0.2: J1.13 v67.5,36.4 | R8.2 v49.51,36.39 v49.5,36.4 | U3.9 v43.09,34.7 v43.1,34.7
SDA0  (via drill 0.3 pad 0.6)
  Route15 0.2: v39.8,43.62 40.5,42.92 40.5,29.2 39.1,27.8 39.1,21.3 44.3,16.1 50.5,16.1 v53,18.6
  Bottom 0.2: JP1.18 v53.01,18.61 v53,18.6 | U1.15 v39.8,43.62
VCOM
  Bottom 0.2: C13.1 62.2,30.9 J1.24
VDD  (via drill 0.3 pad 0.6)
  Route2 0.2: v38.2,19.6 37.3,19.6 36.8,20.1 36.8,28 38.5,29.7 v38.5,37.95 v38.5,44.27
  Bottom 0.2: JP1.16 R12.1 51.5,16.8 48.8,19.5 47.4,19.5 46.7,20.2 U4.1 | U1.16 v38.5,44.27 37.77,44.27 C1.1 | U4.1 U2.5 41.3,20.2 40.7,19.6 v38.2,19.6 38,19.6 37.5,19.1 R1.1 37.5,17.85 36.5,16.85 C2.1 | U4.1 | U3.14 v38.51,37.96 v38.5,37.95
VSL
  Bottom 0.2: J1.22 63.7,31.9 62,33.6 C9.1

### Text on the board
tPlace: BIGCLOWN.COM | by VPetras
bPlace: E-PAPER | MODULE | R1.0 | BIGCLOWN.COM | SPI | 3-line | 4-line | by VPetras
Document: EPAPER MODULE (c) by HARDWARIO s.r.o. | EPAPER MODULE is licensed under the | CERN Open Hardware Licence version 1.2. | You should have received a copy of the licence along with this | work. If not, see <http://www.ohwr.org/cernohl>.